# EasyEDA schematic Amiga 2000 Video to HDMI_2021-02-06.json
TITLE: A2000 Video Slot to HDMI; REV: 1.0; Date: 2021-02-06; Sheet: 1/1; Drawn By: cdhooper; Company: eebugs.com
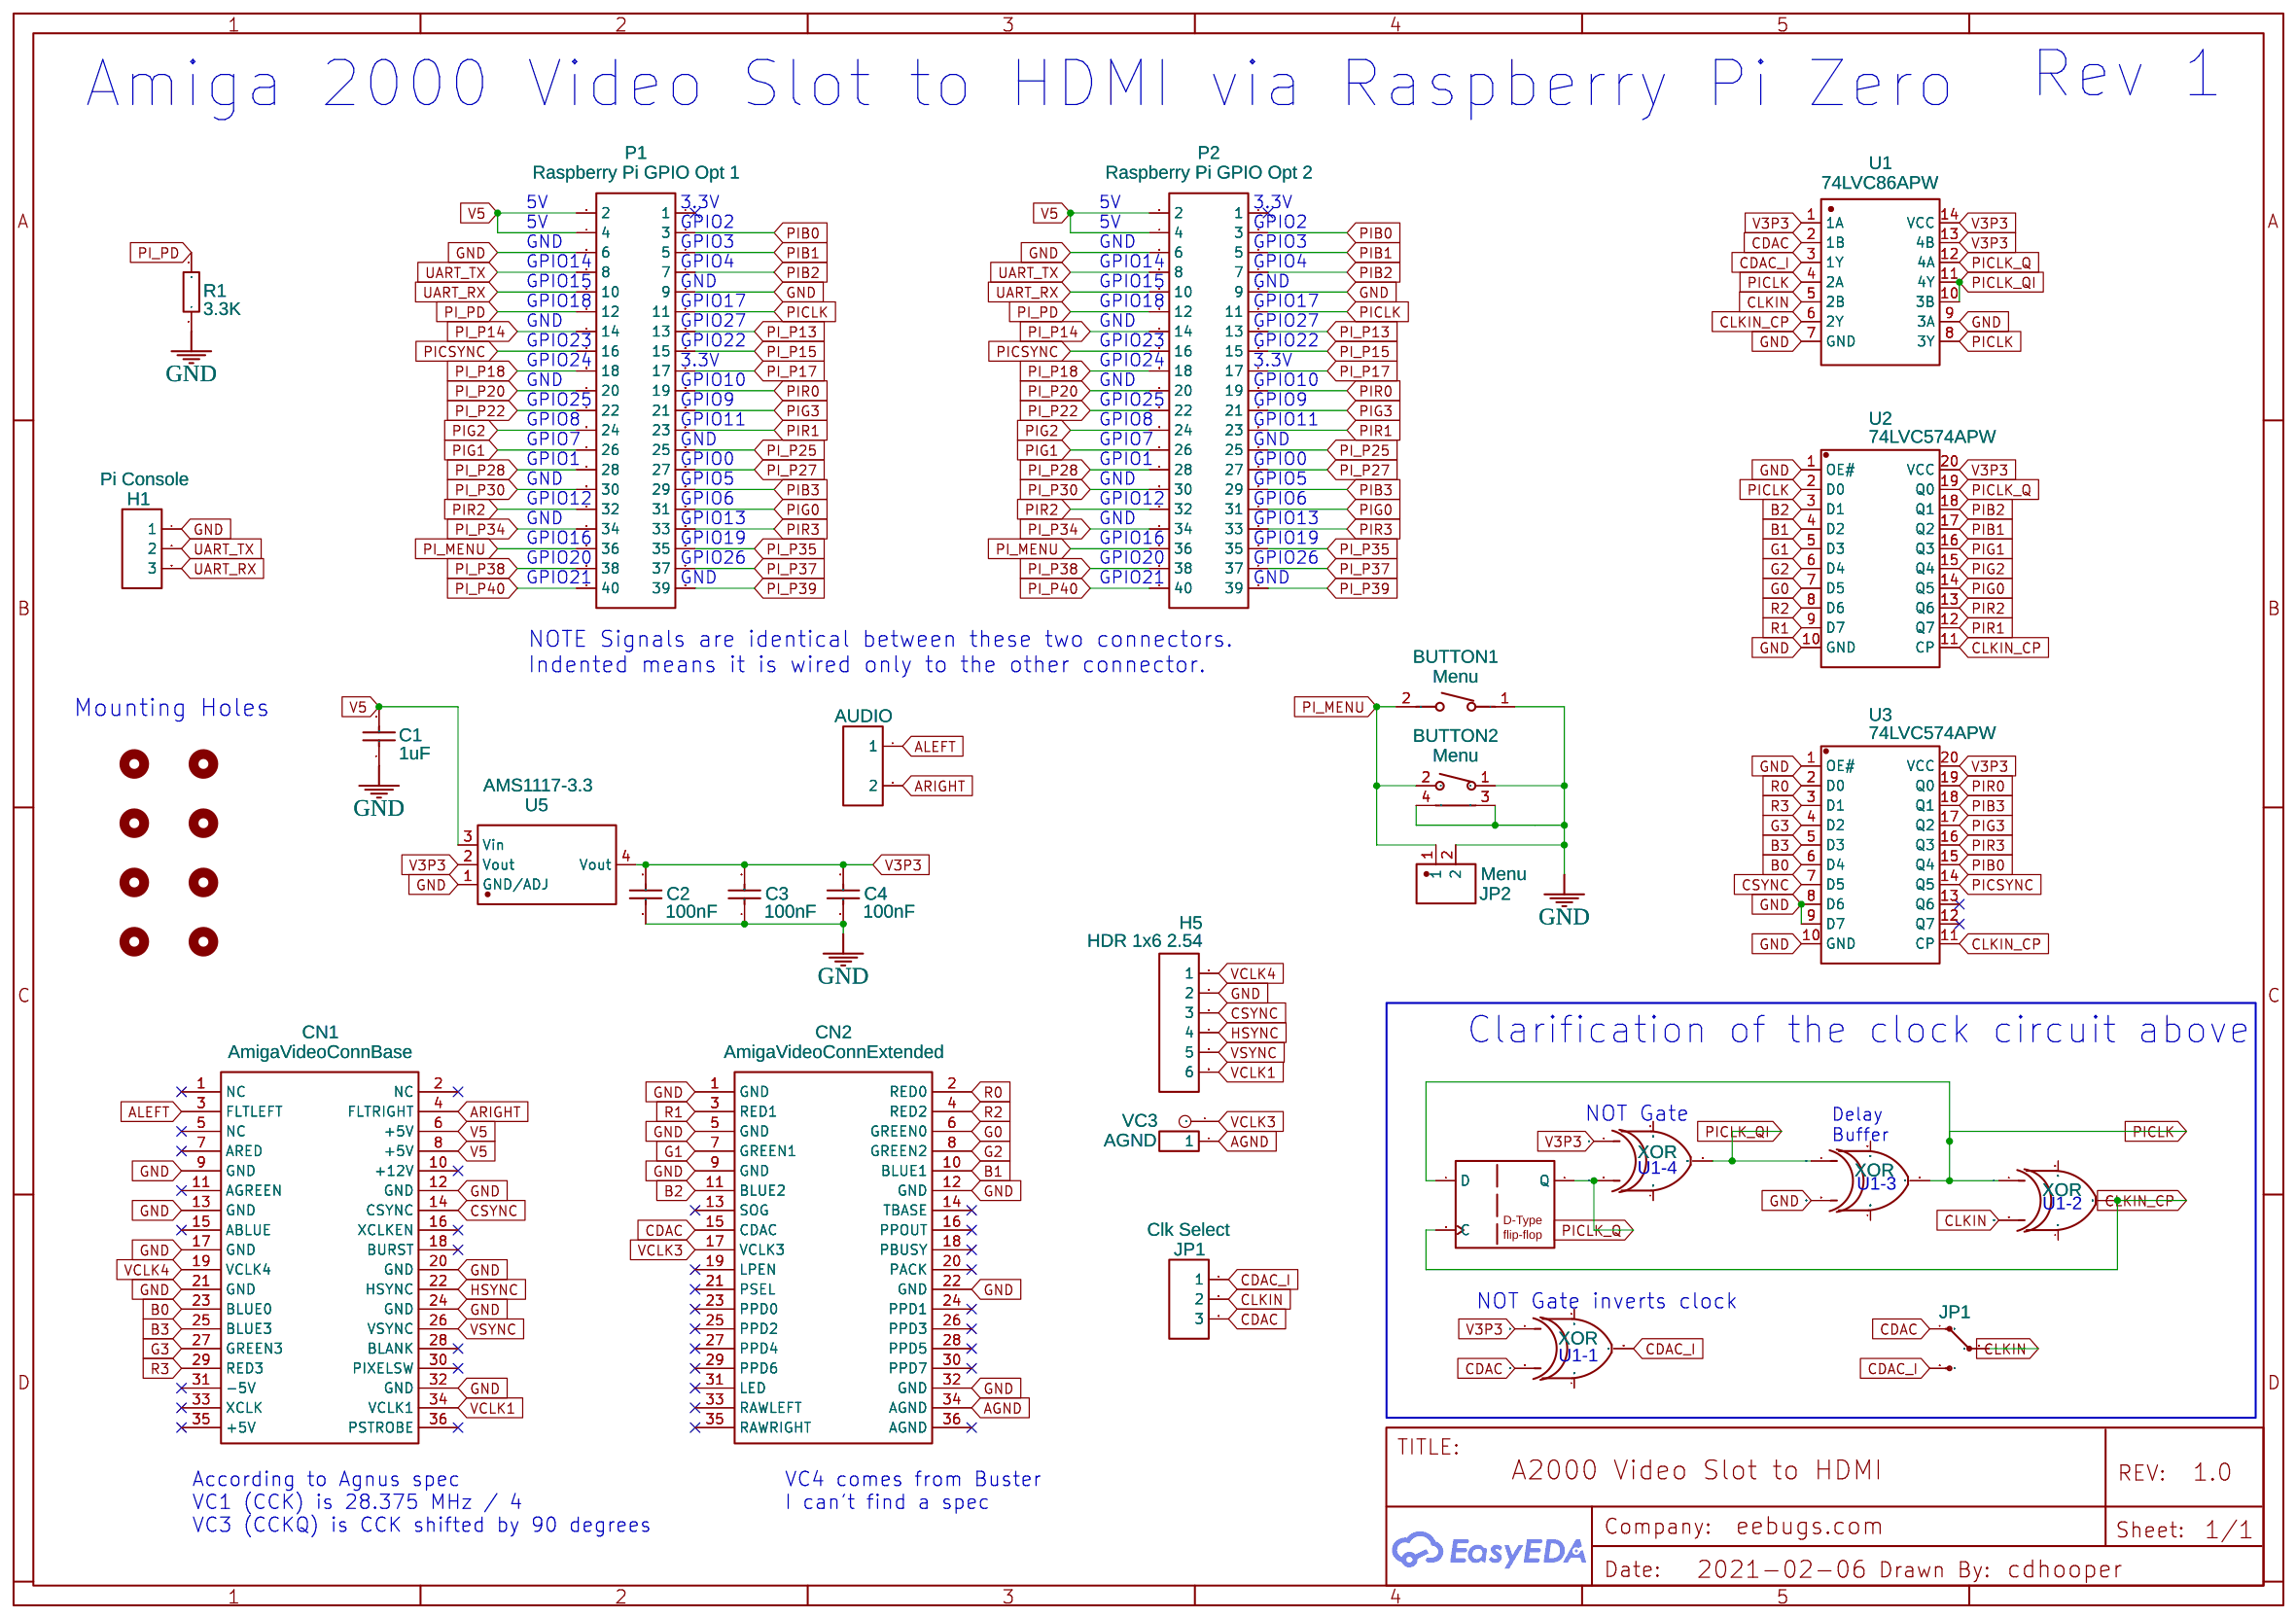
[diagram p0: schematic sheet]

## Parts
B1  VC3  [TEST_POINT_SMD_1MM]
BUTTON1  Menu  [KAN0631K-1001B]
BUTTON2  Menu  [SW-TH_TS-1093C-A14B3-D1]
C1  1uF  [C0805]
C2  100nF  [C0805]
C3  100nF  [C0805]
C4  100nF  [C0805]
CN1  AmigaVideoConnBase  [PCB_VIDEOSLOTAMIGASMALL]
CN2  AmigaVideoConnExtended  [PCB_VIDEOSLOTAMIGASMALL]
H1  Pi Console  [HDR-3X1/2.54]
H3  AGND  [HDR-TH_1P-P2.54-V-M]
H4  AUDIO  [HDR-TH_2P-P2.54-V]
H5  HDR 1x6 2.54  [HDR-TH_6P-P2.54-V]
JP1  Clk Select  [HDR-3X1/2.54]
JP2  Menu  [HDR-2X1/2.54]
MK1  Mounting_Hole  [MOUNTING HOLE]
MK2  Mounting_Hole  [MOUNTING HOLE]
MK3  Mounting_Hole  [MOUNTING HOLE]
MK4  Mounting_Hole  [MOUNTING HOLE]
MK5  Mounting_Hole  [MOUNTING HOLE]
MK6  Mounting_Hole  [MOUNTING HOLE]
MK7  Mounting_Hole  [MOUNTING HOLE]
MK8  Mounting_Hole  [MOUNTING HOLE]
P1  Raspberry Pi GPIO Opt 1  [HDR-TH_40P-P2.54-V-R2-C20-S2.54]
P2  Raspberry Pi GPIO Opt 2  [HDR-TH_40P-P2.54-V-R2-C20-S2.54]
R1  3.3K  [R0805]
S1  JP1  [SWITCH-SPDT]
U1  74LVC86APW  [TSSOP-14_L5.0-W4.4-P0.65-LS6.4-BL]
U2  74LVC574APW  [TSSOP-20_L6.5-W4.4-P0.65-LS6.4-BL]
U3  74LVC574APW  [TSSOP-20_L6.5-W4.4-P0.65-LS6.4-BL]
U4  XOR
U5  AMS1117-3.3  [SOT-223-3_L6.5-W3.4-P2.30-LS7.0-BR]
U6  XOR
U7  XOR
U8  XOR
U9  D-type flip-flop

## Library data of the parts
B1 = TEST_POINT_SMD_1MM: Contributor: l.bispo
BUTTON1 = -: Supplier: LCSC; Supplier Part: C231660; Manufacturer: GANGYUAN; Contributor: LCSC; Mounted: No
BUTTON2 = TS-1093C-A14B3-D1: Supplier: LCSC; Supplier Part: C493022; Manufacturer: Yuandi; Contributor: LCSC; LCSC Assembly: Yes; SMT Type: Extend
C1 = CL21B105KBFNNNE: Supplier: LCSC; Manufacturer: SAMSUNG; LCSC Assembly: Yes; Supplier Part: C28323; SMT Type: Basic
C2-C4 = CC0805KRX7R9BB104: Supplier: LCSC; Manufacturer: YAGEO; LCSC Assembly: Yes; Supplier Part: C49678; SMT Type: Basic
CN1 CN2 = -: Manufacturer Part: New SchematicLib; Contributor: CASblt
H1 JP1 = -: Supplier Part: C146243; Supplier: LCSC; Manufacturer: Boom Precision Elec; Manufacturer Part: Header-Female-2.54_1x3; link: https://datasheet.lcsc.com/szlcsc/Boom-Precision-Elec-2-54mm-1-8P-Straight-Female-header_C27438.pdf
H3 = Header-Male-2.54_1x1: Supplier: LCSC; Manufacturer: ReliaPro; Supplier Part: C81276; LCSC Assembly: Yes; SMT Type: Extend
H4 = Header-Male-2.54_1x2: Supplier: LCSC; Manufacturer: TE Connectivity; Manufacturer Part: 826629-2; image: //image.lceda.cn/szlcsc/C86471.jpg; Supplier Part: C86471; LCSC Assembly: Yes; SMT Type: Extend
H5 = Header-Male-2.54_1x6: Supplier: LCSC; Manufacturer: BOOMELE; Supplier Part: C37208; LCSC Assembly: Yes; SMT Type: Extend
JP2 = -: Supplier: LCSC; Manufacturer: ZHENGLING; Manufacturer Part: Z-211-0211-0021-001; Contributor: LCSC; Supplier Part: C152154
MK1-MK8 = -: Contributor: KiCAD; license: https://www.gnu.org/licenses/lgpl-2.1.html; Manufacturer Part: ?
P1 P2 = Header-Female-2.54_2x20: Supplier: LCSC; Manufacturer: BOOMELE; Manufacturer Part: 2.54mm 2*20PFemale header; image: //image.lceda.cn/szlcsc/C50982.jpg; Supplier Part: C50982; LCSC Assembly: Yes; SMT Type: Extend
R1 = 0805W8F3301T5E: Supplier: LCSC; Manufacturer: UniOhm; Supplier Part: C26010; SMT Type: Basic; JLCPCB SMD: Yes; LCSC Assembly: Yes
S1 = Switch: sourceId: ceKgMGAuL
U1 = 74LVC86APW: Supplier: LCSC; Manufacturer: PHILIPS; image: //image.lceda.cn/szlcsc/C6102.jpg; Supplier Part: C6102; SMT Type: Extend; JLCPCB SMD: Yes; LCSC Assembly: Yes
U2 U3 = 74LVC574APW: Supplier: LCSC; Manufacturer: PHILIPS; image: //image.lceda.cn/szlcsc/C6098.jpg; Supplier Part: C6098; SMT Type: Extend; JLCPCB SMD: Yes; LCSC Assembly: Yes
U4 U6-U8 = LOGIC: Contributor: EasyEDA; Package Display: No
U5 = AMS1117-3.3: sourceId: dwIGgezVh; Supplier: LCSC; Manufacturer: AMS; image: //image.lceda.cn/szlcsc/C6186.jpg; Supplier Part: C6186; SMT Type: Basic; JLCPCB SMD: Yes; LCSC Assembly: Yes
U9 = D-type flip-flop: Supplier Part: None; Contributor: cdhooper

## Nets
AGND: CN2.34(AGND) H3.1
GND: BUTTON1.1 BUTTON2.1 BUTTON2.3(EP) BUTTON2.4(EP) C1.1 C2.1 C3.1 C4.1 CN1.9(GND) CN1.12(GND) CN1.13(GND) CN1.17(GND) CN1.20(GND) CN1.21(GND) CN1.24(GND) CN1.32(GND) CN2.1(GND) CN2.5(GND) CN2.9(GND) CN2.12(GND) CN2.22(GND) CN2.32(GND) H1.1 H5.2 JP2.2 P1.6 P1.9 P2.6 P2.9 R1.1 U1.7(GND) U1.9(3A) U2.1(OE#) U2.10(GND) U3.1(OE#) U3.8(D6) U3.9(D7) U3.10(GND) U5.1(GND/ADJ) U8.2 (INB)
V3P3: C2.2 C3.2 C4.2 U1.1(1A) U1.13(4B) U1.14(VCC) U2.20(VCC) U3.20(VCC) U4.1 (INA) U5.2(Vout) U5.4(Vout) U7.1 (INA)
V5: C1.2 CN1.6(+5V) CN1.8(+5V) P1.2 P1.4 P2.2 P2.4 U5.3(Vin)
ALEFT: CN1.3(FLTLEFT) H4.1
ARIGHT: CN1.4(FLTRIGHT) H4.2
B0: CN1.23(BLUE0) U3.6(D4)
B1: CN2.10(BLUE1) U2.4(D2)
B2: CN2.11(BLUE2) U2.3(D1)
B3: CN1.25(BLUE3) U3.5(D3)
CDAC: CN2.15(CDAC) JP1.3 S1.1(O) U1.2(1B) U4.2 (INB)
CDAC_I: JP1.1 S1.3(S) U1.3(1Y) U4.5(OUT)
CLKIN: JP1.2 S1.2(P) U1.5(2B) U6.2 (INB)
CLKIN_CP: U1.6(2Y) U2.11(CP) U3.11(CP) U6.5(OUT) U9.2(C)
CSYNC: CN1.14(CSYNC) H5.3 U3.7(D5)
G0: CN2.6(GREEN0) U2.7(D5)
G1: CN2.7(GREEN1) U2.5(D3)
G2: CN2.8(GREEN2) U2.6(D4)
G3: CN1.27(GREEN3) U3.4(D2)
HSYNC: CN1.22(HSYNC) H5.4
PI_MENU: BUTTON1.2 BUTTON2.2 JP2.1 P1.36 P2.36
PI_P13: P1.13 P2.13
PI_P14: P1.14 P2.14
PI_P15: P1.15 P2.15
PI_P17: P1.17 P2.17
PI_P18: P1.18 P2.18
PI_P20: P1.20 P2.20
PI_P22: P1.22 P2.22
PI_P25: P1.25 P2.25
PI_P27: P1.27 P2.27
PI_P28: P1.28 P2.28
PI_P30: P1.30 P2.30
PI_P34: P1.34 P2.34
PI_P35: P1.35 P2.35
PI_P37: P1.37 P2.37
PI_P38: P1.38 P2.38
PI_P39: P1.39 P2.39
PI_P40: P1.40 P2.40
PI_PD: P1.12 P2.12 R1.2
PIB0: P1.3 P2.3 U3.15(Q4)
PIB1: P1.5 P2.5 U2.17(Q2)
PIB2: P1.7 P2.7 U2.18(Q1)
PIB3: P1.29 P2.29 U3.18(Q1)
PICLK: P1.11 P2.11 U1.4(2A) U1.8(3Y) U2.2(D0) U6.1 (INA) U8.5(OUT) U9.1(D)
PICLK_Q: U1.12(4A) U2.19(Q0) U7.2 (INB) U9.3(Q)
PICLK_QI: U1.10(3B) U1.11(4Y) U7.5(OUT) U8.1 (INA)
PICSYNC: P1.16 P2.16 U3.14(Q5)
PIG0: P1.31 P2.31 U2.14(Q5)
PIG1: P1.26 P2.26 U2.16(Q3)
PIG2: P1.24 P2.24 U2.15(Q4)
PIG3: P1.21 P2.21 U3.17(Q2)
PIR0: P1.19 P2.19 U3.19(Q0)
PIR1: P1.23 P2.23 U2.12(Q7)
PIR2: P1.32 P2.32 U2.13(Q6)
PIR3: P1.33 P2.33 U3.16(Q3)
R0: CN2.2(RED0) U3.2(D0)
R1: CN2.3(RED1) U2.9(D7)
R2: CN2.4(RED2) U2.8(D6)
R3: CN1.29(RED3) U3.3(D1)
UART_RX: H1.3 P1.10 P2.10
UART_TX: H1.2 P1.8 P2.8
VCLK1: CN1.34(VCLK1) H5.6
VCLK3: B1.1(TP) CN2.17(VCLK3)
VCLK4: CN1.19(VCLK4) H5.1
VSYNC: CN1.26(VSYNC) H5.5

Not connected (* = marked no-connect by the designer): CN1 1(NC)* 2(NC)* 5(NC)* 7(ARED)* 10(+12V)* 11(AGREEN)* 15(ABLUE)* 16(XCLKEN)* 18(BURST)* 28(BLANK)* 30(PIXELSW)* 31(-5V)* 33(XCLK)* 35(+5V)* 36(PSTROBE)*; CN2 13(SOG)* 14(TBASE)* 16(PPOUT)* 18(PBUSY)* 19(LPEN)* 20(PACK)* 21(PSEL)* 23(PPD0)* 24(PPD1)* 25(PPD2)* 26(PPD3)* 27(PPD4)* 28(PPD5)* 29(PPD6)* 30(PPD7)* 31(LED)* 33(RAWLEFT)* 35(RAWRIGHT)* 36(AGND)*; P1 1*; P2 1*; U3 12(Q7)* 13(Q6)*; U4 3(VDD) 4(GND); U6 3(VDD) 4(GND); U7 3(VDD) 4(GND); U8 3(VDD) 4(GND)

## Notes on the sheet
- Rev 1
- Amiga 2000 Video Slot to HDMI via Raspberry Pi Zero
- 5V
- 3.3V
- 5V
- 3.3V
- 5V
- GND
- GPIO2
- GPIO3
- 5V
- GND
- GPIO2
- GPIO3
- GPIO14
- GPIO4
- GPIO14
- GPIO4
- GPIO15
- GND
- GPIO15
- GND
- GPIO18
- GPIO17
- GPIO18
- GPIO17
- GND
- GPIO27
- GND
- GPIO27
- GPIO23
- GPIO22
- GPIO23
- GPIO22
- GND
- GPIO24
- 3.3V
- GPIO10
- GND
- GPIO24
- 3.3V
- GPIO10
- GPIO25
- GPIO9
- GPIO25
- GPIO9
- GPIO8
- GPIO11
- GPIO8
- GPIO11
- GPIO7
- GND
- GPIO7
- GND
- GPIO1
- GPIO0
- GPIO1
- GPIO0
- GND
- GPIO12
- GPIO5
- GPIO6
- GND
- GPIO12
- GPIO5
- GPIO6
- GND
- GPIO13
- GND
- GPIO13
- GPIO16
- GPIO19
- GPIO16
- GPIO19
- GPIO20
- GPIO26
- GPIO20
- GPIO26
- GPIO21
- GND
- GPIO21
- GND
- NOTE Signals are identical between these two connectors.
  Indented means it is wired only to the other connector.
- Mounting Holes
- Clarification of the clock circuit above
- NOT Gate
- Delay
  Buffer
- U1-4
- U1-3
- U1-2
- NOT Gate inverts clock
- U1-1
- According to Agnus spec
  VC1 (CCK) is 28.375 MHz / 4
  VC3 (CCKQ) is CCK shifted by 90 degrees
- VC4 comes from Buster
  I can't find a spec
